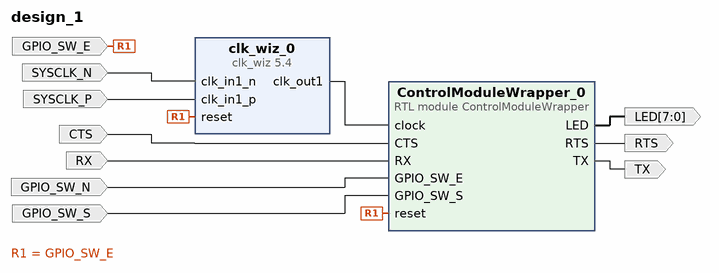
[diagram p0: block diagram of the top level]
# Vivado block design design_1, xc7vx485tffg1761-2, Vivado 2017.2
create_bd_design design_1

create_bd_port -dir I -type clk SYSCLK_N
create_bd_port -dir I -type clk SYSCLK_P
create_bd_port -dir I CTS
create_bd_port -dir O -from 7 -to 0 LED
create_bd_port -dir O RTS
create_bd_port -dir I RX
create_bd_port -dir O TX
create_bd_port -dir I -type rst GPIO_SW_E
set_property -dict {CONFIG.POLARITY ACTIVE_HIGH} [get_bd_ports GPIO_SW_E]
create_bd_port -dir I GPIO_SW_N
create_bd_port -dir I GPIO_SW_S

create_bd_cell -type ip -vlnv xilinx.com:ip:clk_wiz:5.4 clk_wiz_0
set_property -dict [list \
  CONFIG.CLKIN1_JITTER_PS 50.0 \
  CONFIG.PRIM_SOURCE Differential_clock_capable_pin \
  CONFIG.MMCM_DIVCLK_DIVIDE 1 \
  CONFIG.MMCM_CLKFBOUT_MULT_F 5.000 \
  CONFIG.MMCM_CLKIN1_PERIOD 5.000 \
  CONFIG.MMCM_CLKIN2_PERIOD 10.0 \
  CONFIG.USE_BOARD_FLOW true \
  CONFIG.CLK_IN1_BOARD_INTERFACE sys_diff_clock \
  CONFIG.RESET_BOARD_INTERFACE reset \
  CONFIG.CLKOUT1_JITTER 112.316 \
  CONFIG.CLKOUT1_PHASE_ERROR 89.971 \
] [get_bd_cells clk_wiz_0]
create_bd_cell -type module -reference ControlModuleWrapper ControlModuleWrapper_0

# ---- connections ----

connect_bd_net -net clk_in1_n_1 [get_bd_ports SYSCLK_N] [get_bd_pins clk_wiz_0/clk_in1_n]
connect_bd_net -net clk_in1_p_1 [get_bd_ports SYSCLK_P] [get_bd_pins clk_wiz_0/clk_in1_p]
connect_bd_net [get_bd_pins clk_wiz_0/clk_out1] [get_bd_pins ControlModuleWrapper_0/clock]
connect_bd_net -net CTS_1_1 [get_bd_ports CTS] [get_bd_pins ControlModuleWrapper_0/CTS]
connect_bd_net [get_bd_pins ControlModuleWrapper_0/LED] [get_bd_ports LED]
connect_bd_net [get_bd_pins ControlModuleWrapper_0/RTS] [get_bd_ports RTS]
connect_bd_net [get_bd_ports RX] [get_bd_pins ControlModuleWrapper_0/RX]
connect_bd_net -net GPIO_SW_E_1_1 [get_bd_ports GPIO_SW_N] [get_bd_pins ControlModuleWrapper_0/GPIO_SW_E]
connect_bd_net [get_bd_ports GPIO_SW_S] [get_bd_pins ControlModuleWrapper_0/GPIO_SW_S]
connect_bd_net -net reset_1 [get_bd_ports GPIO_SW_E] [get_bd_pins clk_wiz_0/reset] [get_bd_pins ControlModuleWrapper_0/reset]
connect_bd_net [get_bd_pins ControlModuleWrapper_0/TX] [get_bd_ports TX]

validate_bd_design
save_bd_design
